# Altium project mini_lathe_motor_monitor.PrjPcb
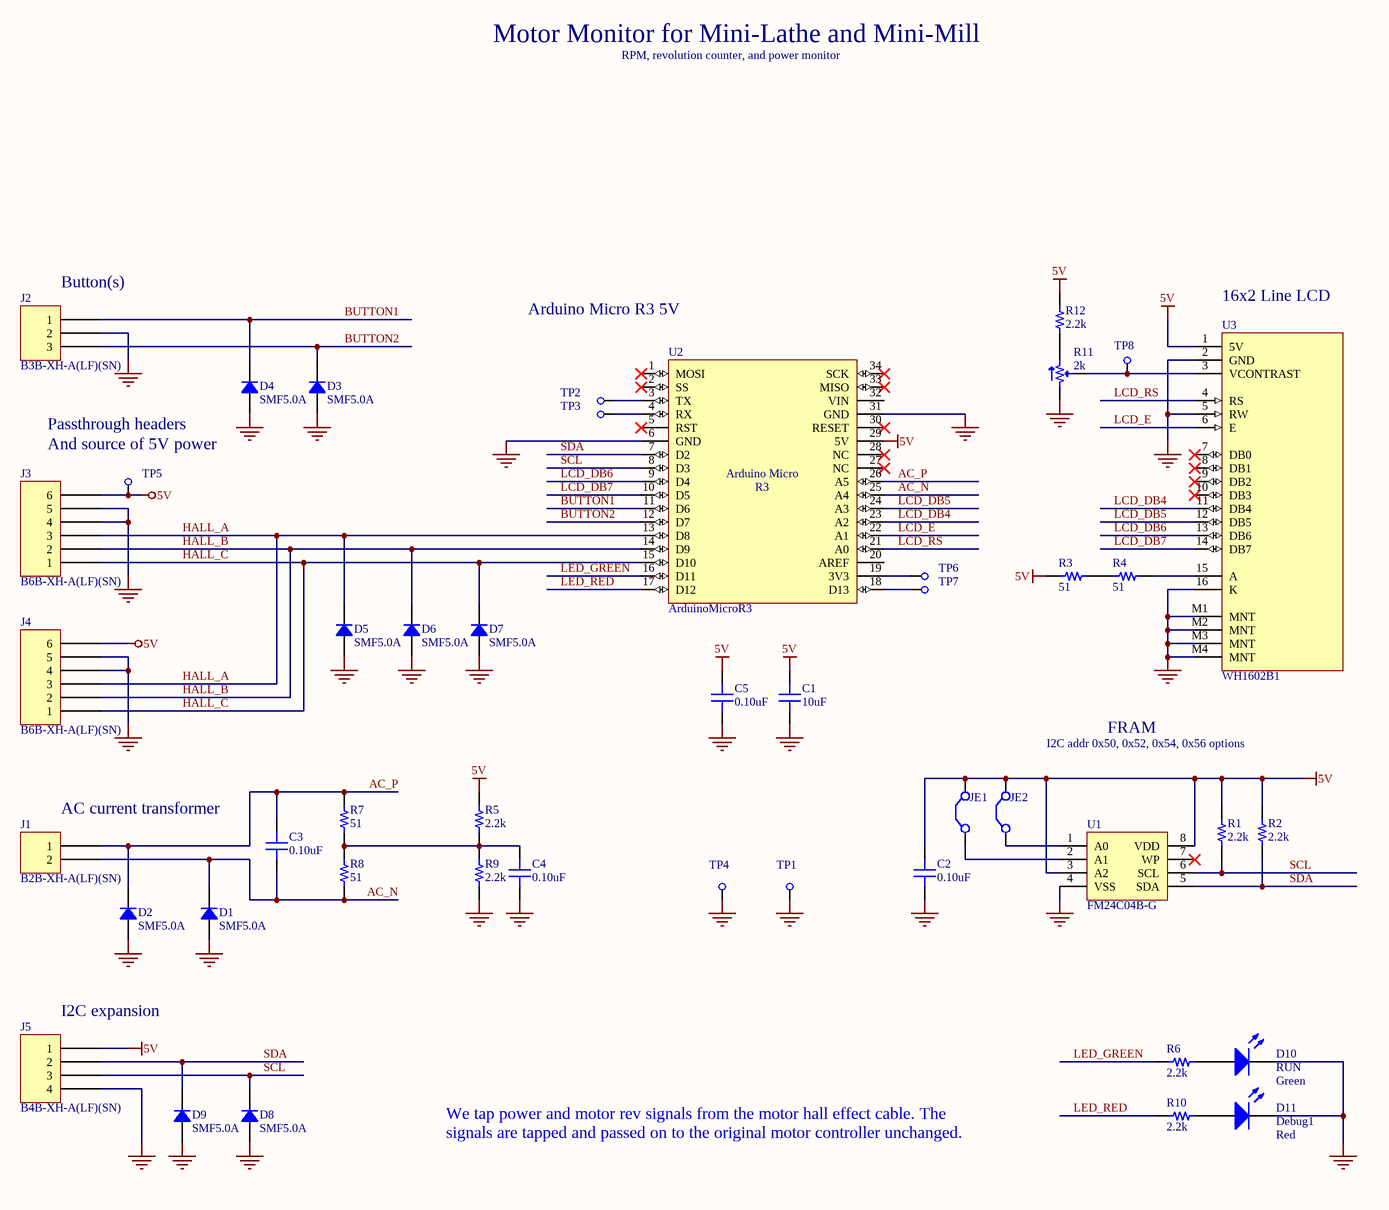
[diagram p0: mini_lathe_motor_monitor.SchDoc]
PCB_TITLE: MOTOR MONITOR; PCB_REV: A; PCB_PART_NUM: N/A; PCB_DWG_NUM: N/A; PCB_DESIGNER: B. Kuschak; ENGINEER: B. Kuschak
1 sheet, 46 parts. Net scope: global (net labels, ports and power ports of the same name join across sheets).
Board file: mini_lathe_motor_monitor.PcbDoc

## Sheet mini_lathe_motor_monitor.SchDoc: Mini-Lathe Motor Monitor
size C; SheetNumber: 1; SheetTotal: 1; PageSetup: Record=PageOptions|CenterHorizontal=True|CenterVertical=True|PrintScale=1.00|XCorrection=1.00|YCorrection=1.00|PrintKind=0|BorderSize=5000000|LeftOffset=0|BottomOffset=0|Orientation=2|PaperLength=1000|PaperWidth=1000|Scale=100|PaperSource=7|PrintQuality=-3|MediaType=1|DitherType=10|PrintScaleMode=1|PaperKind=11x17|PaperIndex=17

### Parts
C1  10uF  [CAP 0805/2012]
C2  0.10uF  [CAP 0603/1608]
C3  0.10uF  [CAP 0603/1608]
C4  0.10uF  [CAP 0603/1608]
C5  0.10uF  [CAP 0603/1608]
D1  SMF5.0A  [SOD123F]
D2  SMF5.0A  [SOD123F]
D3  SMF5.0A  [SOD123F]
D4  SMF5.0A  [SOD123F]
D5  SMF5.0A  [SOD123F]
D6  SMF5.0A  [SOD123F]
D7  SMF5.0A  [SOD123F]
D8  SMF5.0A  [SOD123F]
D9  SMF5.0A  [SOD123F]
D10  RUN  [0603R-GENERIC]
D11  Debug1  [0603R-GENERIC]
J1  B2B-XH-A(LF)(SN)  [JST XH B2B-XH-A]
J2  B3B-XH-A(LF)(SN)  [JST XH B3B-XH-A]
J3  B6B-XH-A(LF)(SN)  [JST XH B6B-XH-A]
J4  B6B-XH-A(LF)(SN)  [JST XH B6B-XH-A]
J5  B4B-XH-A(LF)(SN)  [JST XH B4B-XH-A]
JE1  Jumper  [SOLDER_JUMPER1]  (value not drawn)  (no BOM)
JE2  Jumper  [SOLDER_JUMPER1]  (value not drawn)  (no BOM)
R1  2.2k  [RES 0603/1608]
R2  2.2k  [RES 0603/1608]
R3  51  [RES 0603/1608]
R4  51  [RES 0603/1608]
R5  2.2k  [RES 0603/1608]
R6  2.2k  [RES 0603/1608]
R7  51  [RES 0603/1608]
R8  51  [RES 0603/1608]
R9  2.2k  [RES 0603/1608]
R10  2.2k  [RES 0603/1608]
R11  2k  [POT Panasonic EVM]
R12  2.2k  [RES 0603/1608]
TP1  TESTPOINT  [TESTPOINT_ROUND_30MIL]  (value not drawn)  (no BOM)
TP2  TESTPOINT  [TESTPOINT_ROUND_30MIL]  (value not drawn)  (no BOM)
TP3  TESTPOINT  [TESTPOINT_ROUND_30MIL]  (value not drawn)  (no BOM)
TP4  TESTPOINT  [TESTPOINT_ROUND_30MIL]  (value not drawn)  (no BOM)
TP5  TESTPOINT  [TESTPOINT_ROUND_30MIL]  (value not drawn)  (no BOM)
TP6  TESTPOINT  [TESTPOINT_ROUND_30MIL]  (value not drawn)  (no BOM)
TP7  TESTPOINT  [TESTPOINT_ROUND_30MIL]  (value not drawn)  (no BOM)
TP8  TESTPOINT  [TESTPOINT_ROUND_30MIL]  (value not drawn)  (no BOM)
U1  FM24C04B-G  [SO8_N]
U2  ArduinoMicroR3  [ARDUINO_MICRO_R3]
U3  WH1602B1

### Nets
5V: C1.1 C2.2 C5.2 J3.6 J4.6 J5.1 JE1.2(C2) JE2.2(C2) R1.1 R2.1 R3.1 R5.1 R12.1 TP5.1 U1.3(A2) U1.8(VDD) U2.29(5V) U3.1(5V)
GND: C1.2 C2.1 C4.1 C5.1 D1.1 D2.1 D3.1 D4.1 D5.1 D6.1 D7.1 D8.1 D9.1 D10.2(K) D11.2(K) J2.2 J3.4 J3.5 J4.4 J4.5 J5.4 R9.2 R11.1 TP1.1 TP4.1 U1.4(VSS) U2.6(GND) U2.31(GND) U3.2(GND) U3.5(RW) U3.16(K) U3.M1(MNT) U3.M2(MNT) U3.M3(MNT) U3.M4(MNT)
AC_N: C3.1 D1.2 J1.2 R8.2 U2.25(A4)
AC_P: C3.2 D2.2 J1.1 R7.1 U2.26(A5)
BUTTON1: D4.2 J2.1 U2.11(D6)
BUTTON2: D3.2 J2.3 U2.12(D7)
HALL_A: D5.2 J3.3 J4.3 U2.13(D8)
HALL_B: D6.2 J3.2 J4.2 U2.14(D9)
HALL_C: D7.2 J3.1 J4.1 U2.15(D10)
LCD_DB4: U2.23(A2) U3.11(DB4)
LCD_DB5: U2.24(A3) U3.12(DB5)
LCD_DB6: U2.9(D4) U3.13(DB6)
LCD_DB7: U2.10(D5) U3.14(DB7)
LCD_E: U2.22(A1) U3.6(E)
LCD_RS: U2.21(A0) U3.4(RS)
LED_GREEN: R6.1 U2.16(D11)
LED_RED: R10.1 U2.17(D12)
SCL: D8.2 J5.3 R1.2 U1.6(SCL) U2.8(D3)
SDA: D9.2 J5.2 R2.2 U1.5(SDA) U2.7(D2)
NetC4_2: C4.2 R5.2 R7.2 R8.1 R9.1
NetD10_1: D10.1(A) R6.2
NetD11_1: D11.1(A) R10.2
NetJE1_1: JE1.1(C1) U1.2(A1)
NetJE2_1: JE2.1(C1) U1.1(A0)
NetR3_2: R3.2 R4.1
NetR4_2: R4.2 U3.15(A)
NetR11_2: R11.2 TP8.1 U3.3(VCONTRAST)
NetR11_3: R11.3 R12.2
NetTP2_1: TP2.1 U2.3(TX)
NetTP3_1: TP3.1 U2.4(RX)
NetTP6_1: TP6.1 U2.19(3V3)
NetTP7_1: TP7.1 U2.18(D13)

Not connected (* = marked no-connect by the designer): U1 7(WP)*; U2 1(MOSI)* 2(SS)* 5(RST)* 20(AREF) 27(NC)* 28(NC)* 30(RESET)* 32(VIN) 33(MISO)* 34(SCK)*; U3 7(DB0)* 8(DB1)* 9(DB2)* 10(DB3)*

### Notes on the sheet
- Motor Monitor for Mini-Lathe and Mini-Mill
- RPM, revolution counter, and power monitor
- (near J2) Button(s)
- Arduino Micro R3 5V
- (near U3) 16x2 Line LCD
- Passthrough headers
- And source of 5V power
- I2C addr 0x50, 0x52, 0x54, 0x56 options
- FRAM
- AC current transformer
- (near J5) I2C expansion
- Green
- We tap power and motor rev signals from the motor hall effect cable. The signals are tapped and passed on to the original motor controller unchanged.
- (near D11) Red
- Title
- Size:
- Date:
- File:
- C
- Number:
- Time:
- Revision:
- Sheet
- of
- (in symbol ArduinoMicroR3) Arduino Micro; R3

### Library data of the parts
C1 = 13702: CAP CER 10UF 10V X7R 0805; Part Number: GRM21BR71A106KE51L; Manufacturer: Murata Electronics North America; TemperatureRange: -55C ~ 125C; Tolerance: 10%; Value: 10uF; PartId: 13702; Supplier 1: Digi-Key; Supplier Part Number 1: 490-3905-2-ND; ComponentLink1Description: Datasheet; ComponentLink1URL: http://www.murata.com/~/media/webrenewal/support/library/catalog/products/capacitor/mlcc/c02e.pdf; ComponentLink2Description: Digi-Key Listing; ComponentLink2URL: https://www.digikey.com/product-detail/en/murata-electronics-north-america/GRM21BR71A106KE51L/490-3905-2-ND/965919; TemperatureCoefficient: X7R; Voltage: 10V; Price: 0.0600; Device Package: 0805 (2012 Metric)
C2-C5 = 12948: CAP CER 0.1UF 16V X7R 0603; Part Number: GRM188R71C104KA01D; Manufacturer: Murata Electronics North America; TemperatureRange: -55C ~ 125C; Tolerance: 10%; Value: 0.10uF; PartId: 12948; Supplier 1: Digi-Key; Supplier Part Number 1: 490-1532-2-ND; ComponentLink1Description: Datasheet; ComponentLink1URL: http://www.murata.com/~/media/webrenewal/support/library/catalog/products/capacitor/mlcc/c02e.pdf; ComponentLink2Description: Digi-Key Listing; ComponentLink2URL: https://www.digikey.com/product-detail/en/murata-electronics-north-america/GRM188R71C104KA01D/490-1532-2-ND/587060; TemperatureCoefficient: X7R; Voltage: 16V; Price: 0.0035; Device Package: 0603 (1608 Metric)
D1-D9 = 7758: TVS DIODE 5VWM 9.2VC SOD123; Manufacturer: Littelfuse Inc.; Type: Surface Mount; Power - Peak Pulse: 200W; Current - Peak Pulse: 21.7A; Voltage (Clamping): 9.2V; Voltage (Breakdown): 6.4V; Voltage (Reverse Standoff): 5V; PartId: 7758; Part Number: SMF5.0A; Supplier 1: Digi-Key; Supplier Part Number 1: F5748TR-ND; ComponentLink1Description: Datasheet; ComponentLink1URL: http://www.littelfuse.com/~/media/electronics/datasheets/tvs_diodes/littelfuse_tvs_diode_smf_datasheet.pdf.pdf; ComponentLink2Description: Digi-Key Listing; ComponentLink2URL: http://www.digikey.ca/product-detail/en/SMF5.0A/F5748TR-ND/3429605; Operating Temperature: -55C ~ 150C (TJ); Price: 0.1656; Device Package: SOD-123F
D10 = LED2: Typical RED, GREEN, YELLOW, AMBER GaAs LED; PartNumber: LTST-C194KGKT; Manufacturer: Lite-On; Published: 8-Jun-2000; LatestRevisionDate: 17-Jul-2002; LatestRevisionNote: Re-released for DXP Platform.; PackageVersion: Feb-2002; PackageReference: 3.2X1.6X1.1; Publisher: Altium Limited; PackageDescription: SM LED; 2 Flat Leads
D11 = LED2: Typical RED, GREEN, YELLOW, AMBER GaAs LED; PartNumber: LS Q976-NR-1; Manufacturer: Osram; Published: 8-Jun-2000; LatestRevisionDate: 17-Jul-2002; LatestRevisionNote: Re-released for DXP Platform.; PackageVersion: Feb-2002; PackageReference: 3.2X1.6X1.1; Publisher: Altium Limited; PackageDescription: SM LED; 2 Flat Leads
J1 = 16449: CONN HEADER XH TOP 2POS 2.5MM; Manufacturer: JST Sales America Inc.; Pitch: 0.098" (2.50mm); Number Of Positions: 2; PartId: 16449; Part Number: B2B-XH-A(LF)(SN); Supplier 1: Digi-Key; Supplier Part Number 1: 455-2247-ND; ComponentLink1Description: Datasheet; ComponentLink1URL: http://www.jst-mfg.com/product/pdf/eng/eXH.pdf; ComponentLink2Description: Digi-Key Listing; ComponentLink2URL: http://www.digikey.com/product-detail/en/jst-sales-america-inc/B2B-XH-A(LF)(SN)/455-2247-ND/1651045; Price: 0.1500; Type: Header, Shrouded; Contact Finish: Tin; Fastening Type: Detent Lock; Number Of Rows: 1; Colour: Natural; Series: XH
J2 = 16450: CONN HEADER XH TOP 3POS 2.5MM; Manufacturer: JST Sales America Inc.; Pitch: 0.098" (2.50mm); Number Of Positions: 3; PartId: 16450; Part Number: B3B-XH-A(LF)(SN); Supplier 1: Digi-Key; Supplier Part Number 1: 455-2248-ND; ComponentLink1Description: Datasheet; ComponentLink1URL: http://www.jst-mfg.com/product/pdf/eng/eXH.pdf; ComponentLink2Description: Digi-Key Listing; ComponentLink2URL: http://www.digikey.com/product-detail/en/jst-sales-america-inc/B3B-XH-A(LF)(SN)/455-2248-ND/1651046; Price: 0.1900; Type: Header, Shrouded; Contact Finish: Tin; Fastening Type: Detent Lock; Number Of Rows: 1; Colour: Natural; Series: XH
J3 J4 = 16453: CONN HEADER XH TOP 6POS 2.5MM; Manufacturer: JST Sales America Inc.; Pitch: 0.098" (2.50mm); Number Of Positions: 6; PartId: 16453; Part Number: B6B-XH-A(LF)(SN); Supplier 1: Digi-Key; Supplier Part Number 1: 455-2271-ND; ComponentLink1Description: Datasheet; ComponentLink1URL: http://www.jst-mfg.com/product/pdf/eng/eXH.pdf; ComponentLink2Description: Digi-Key Listing; ComponentLink2URL: http://www.digikey.com/product-detail/en/jst-sales-america-inc/B6B-XH-A(LF)(SN)/455-2271-ND/1000381; Price: 0.2700; Type: Header, Shrouded; Contact Finish: Tin; Fastening Type: Detent Lock; Number Of Rows: 1; Colour: Natural; Series: XH
J5 = 16451: CONN HEADER XH TOP 4POS 2.5MM; Manufacturer: JST Sales America Inc.; Pitch: 0.098" (2.50mm); Number Of Positions: 4; PartId: 16451; Part Number: B4B-XH-A(LF)(SN); Supplier 1: Digi-Key; Supplier Part Number 1: 455-2249-ND; ComponentLink1Description: Datasheet; ComponentLink1URL: http://www.jst-mfg.com/product/pdf/eng/eXH.pdf; ComponentLink2Description: Digi-Key Listing; ComponentLink2URL: http://www.digikey.com/product-detail/en/jst-sales-america-inc/B4B-XH-A(LF)(SN)/455-2249-ND/1651047; Price: 0.2100; Type: Header, Shrouded; Contact Finish: Tin; Fastening Type: Detent Lock; Number Of Rows: 1; Colour: Natural; Series: XH
JE1 JE2 = Jumper: Jumper Wire; Published: 24-Mar-1999; LatestRevisionDate: 17-Jul-2002; LatestRevisionNote: Re-released for DXP Platform.; PackageReference: RAD-0.2; Publisher: Altium Limited; PackageDescription: Radial Cap, Thru-Hole; 2 Leads; 0.2 in Pin Spacing
R1 R2 R5 R6 R9 R10 R12 = 11184: RES SMD 2.2K OHM 5% 1/10W 0603; Part Number: ERJ-3GEYJ222V; Manufacturer: Panasonic Electronic Components; TemperatureRange: -55C ~ 155C; TemperatureCoefficient: 200ppm/C; PowerRating: 0.1W, 1/10W; Value: 2.2k; PartId: 11184; Supplier 1: Digi-Key; Supplier Part Number 1: P2.2KGTR-ND; ComponentLink1Description: Datasheet; ComponentLink1URL: http://industrial.panasonic.com/www-cgi/jvcr13pz.cgi?E+PZ+3+AOA0001+ERJ3GEYJ222V+7+WW; ComponentLink2Description: Digi-Key Listing; ComponentLink2URL: https://www.digikey.com/product-detail/en/panasonic-electronic-components/ERJ-3GEYJ222V/P2.2KGTR-ND/135862; Tolerance: 5%; Price: 0.0020; Device Package: 0603 (1608 Metric)
R3 R4 R7 R8 = 11421: RES SMD 51 OHM 5% 1/4W 0603; Part Number: ERJ-PA3J510V; Manufacturer: Panasonic Electronic Components; TemperatureRange: -55C ~ 155C; TemperatureCoefficient: 200ppm/C; PowerRating: 0.25W, 1/4W; Value: 51; PartId: 11421; Supplier 1: Digi-Key; Supplier Part Number 1: P51.00BZTR-ND; ComponentLink1Description: Datasheet; ComponentLink1URL: //media.digikey.com/pdf/Data%20Sheets/Panasonic%20Electronic%20Components/ERJ_PA2_P03_PA3_P06_P08_P14.pdf; ComponentLink2Description: Digi-Key Listing; ComponentLink2URL: https://www.digikey.com/product-detail/en/panasonic-electronic-components/ERJ-PA3J510V/P51.00BZTR-ND/5036071; Tolerance: 5%; Price: 0.0115; Device Package: 0603 (1608 Metric)
R11 = 7179: TRIMMER 2K OHM 0.15W SMD; Part Number: EVM-3YSX50B23; Manufacturer: Panasonic Electronic Components; TemperatureCoefficient: 250ppm/C; Tolerance: 25%; Number Of Turns: Single; Adjustment Type: Top Adjustment; Value: 2k; PartId: 7179; Supplier 1: Digi-Key; Supplier Part Number 1: P3Y202TR-ND; ComponentLink1Description: Datasheet; ComponentLink1URL: http://media.digikey.com/pdf/Data%20Sheets/Panasonic%20Resistors%20Thermistors%20PDFs/EVM-3Y_S_R_Rev2010.pdf; ComponentLink2Description: Digi-Key Listing; ComponentLink2URL: http://www.digikey.ca/product-detail/en/EVM-3YSX50B23/P3Y202TR-ND/259777; PowerRating: 0.15W; Price: 0.2543; Type: Surface Mount
U1 = CAT24C256: FM24C04B FRAM; Manufacturer: Cypress; PartNumber: FM24C04B-G
U2 = ArduinoMicroR3: Arduino Micro R3; Manufacturer: Arduino; PartNumber: Micro R3
U3 = LCD: 2x16 LCD; Manufacturer: Winstar; PartNumber: WH1602B1